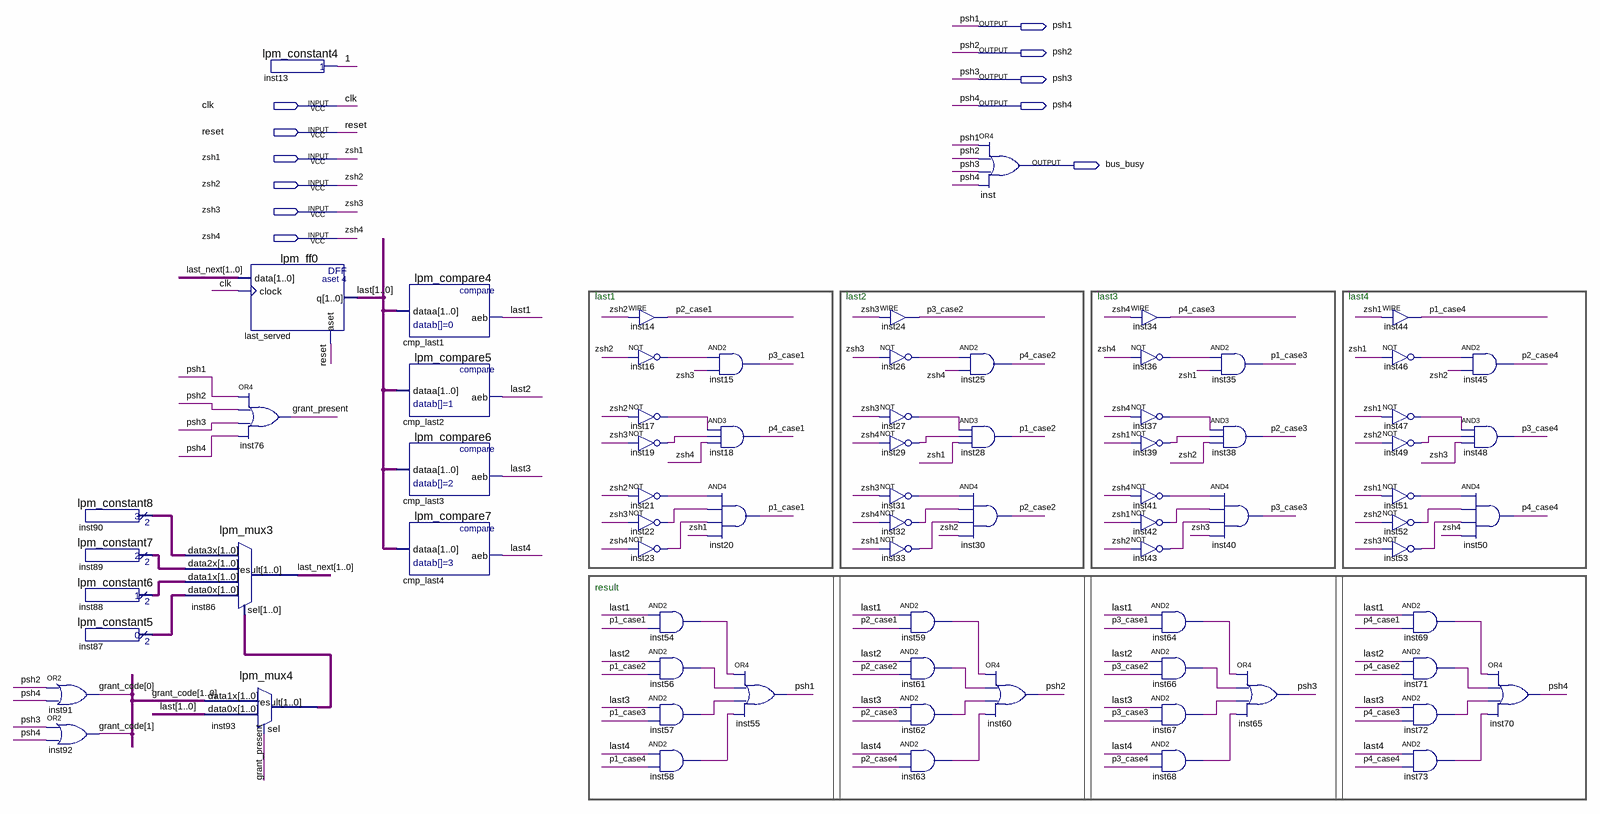
[diagram p0: schematic sheet]
// Quartus schematic arbiter.bdf as structural Verilog: 76 symbols, 11 pins
module arbiter (
  input  clk,
  input  reset,
  input  zsh1,
  input  zsh2,
  input  zsh3,
  input  zsh4,
  output psh1,
  output psh2,
  output psh3,
  output psh4,
  output bus_busy
);

  wire \1 , grant_present, inst16_out, inst17_out, inst19_out, inst21_out, inst22_out, inst23_out,
       inst26_out, inst27_out, inst29_out, inst31_out, inst32_out, inst33_out, inst36_out, inst37_out,
       inst39_out, inst41_out, inst42_out, inst43_out, inst46_out, inst47_out, inst49_out, inst51_out,
       inst52_out, inst53_out, inst54_out, inst56_out, inst57_out, inst58_out, inst59_out, inst61_out,
       inst62_out, inst63_out, inst64_out, inst66_out, inst67_out, inst68_out, inst69_out, inst71_out,
       inst72_out, inst73_out, last2, last3, last4, p1_case1, p1_case2, p1_case3, p1_case4, p2_case1,
       p2_case2, p2_case3, p2_case4, p3_case1, p3_case2, p3_case3, p3_case4, p4_case1, p4_case2, p4_case3,
       p4_case4;
  wire [1:0] grant_code, inst87_result, inst88_result, inst89_result, inst90_result, inst93_result, last,
       last_next;

  or inst91 (grant_code[0], psh2, psh4);
  or inst92 (grant_code[1], psh3, psh4);
  lpm_constant8 inst90 (.result(inst90_result));
  lpm_constant7 inst89 (.result(inst89_result));
  lpm_constant6 inst88 (.result(inst88_result));
  lpm_constant5 inst87 (.result(inst87_result));
  lpm_mux3 inst86 (
    .data3x(inst90_result), .data2x(inst89_result), .data1x(inst88_result), .data0x(inst87_result),
    .sel(inst93_result), .result(last_next));
  lpm_mux4 inst93 (.data1x(grant_code), .data0x(last), .sel(grant_present), .result(inst93_result));
  lpm_constant4 inst13 (.result(\1 ));
  lpm_ff0 last_served (.data(last_next), .clock(clk), .aset(reset), .q(last));
  or inst76 (grant_present, psh1, psh2, psh3, psh4);
  lpm_compare4 cmp_last1 (.dataa(last), .aeb(last[1]));
  lpm_compare5 cmp_last2 (.dataa(last), .aeb(last2));
  lpm_compare6 cmp_last3 (.dataa(last), .aeb(last3));
  lpm_compare7 cmp_last4 (.dataa(last), .aeb(last4));
  assign p2_case1 = zsh2;  // WIRE inst14
  not inst16 (inst16_out, zsh2);
  not inst17 (inst17_out, zsh2);
  not inst19 (inst19_out, zsh3);
  not inst21 (inst21_out, zsh2);
  not inst22 (inst22_out, zsh3);
  not inst23 (inst23_out, zsh4);
  and inst54 (inst54_out, last[1], p1_case1);
  and inst56 (inst56_out, last2, p1_case2);
  and inst57 (inst57_out, last3, p1_case3);
  and inst58 (inst58_out, last4, p1_case4);
  and inst15 (p3_case1, inst16_out, zsh3);
  and inst18 (p4_case1, inst17_out, inst19_out, zsh4);
  and inst20 (p1_case1, inst21_out, inst22_out, inst23_out, zsh1);
  or inst55 (psh1, inst54_out, inst56_out, inst57_out, inst58_out);
  assign p3_case2 = zsh3;  // WIRE inst24
  not inst26 (inst26_out, zsh3);
  not inst27 (inst27_out, zsh3);
  not inst29 (inst29_out, zsh4);
  not inst31 (inst31_out, zsh3);
  not inst32 (inst32_out, zsh4);
  not inst33 (inst33_out, zsh1);
  and inst59 (inst59_out, last[1], p2_case1);
  and inst61 (inst61_out, last2, p2_case2);
  and inst62 (inst62_out, last3, p2_case3);
  and inst63 (inst63_out, last4, p2_case4);
  and inst25 (p4_case2, inst26_out, zsh4);
  and inst28 (p1_case2, inst27_out, inst29_out, zsh1);
  and inst30 (p2_case2, inst31_out, inst32_out, inst33_out, zsh2);
  or inst (bus_busy, psh1, psh2, psh3, psh4);
  or inst60 (psh2, inst59_out, inst61_out, inst62_out, inst63_out);
  assign p4_case3 = zsh4;  // WIRE inst34
  not inst36 (inst36_out, zsh4);
  not inst37 (inst37_out, zsh4);
  not inst39 (inst39_out, zsh1);
  not inst41 (inst41_out, zsh4);
  not inst42 (inst42_out, zsh1);
  not inst43 (inst43_out, zsh2);
  and inst64 (inst64_out, last[1], p3_case1);
  and inst66 (inst66_out, last2, p3_case2);
  and inst67 (inst67_out, last3, p3_case3);
  and inst68 (inst68_out, last4, p3_case4);
  and inst35 (p1_case3, inst36_out, zsh1);
  and inst38 (p2_case3, inst37_out, inst39_out, zsh2);
  and inst40 (p3_case3, inst41_out, inst42_out, inst43_out, zsh3);
  or inst65 (psh3, inst64_out, inst66_out, inst67_out, inst68_out);
  assign p1_case4 = zsh1;  // WIRE inst44
  not inst46 (inst46_out, zsh1);
  not inst47 (inst47_out, zsh1);
  not inst49 (inst49_out, zsh2);
  not inst51 (inst51_out, zsh1);
  not inst52 (inst52_out, zsh2);
  not inst53 (inst53_out, zsh3);
  and inst69 (inst69_out, last[1], p4_case1);
  and inst71 (inst71_out, last2, p4_case2);
  and inst72 (inst72_out, last3, p4_case3);
  and inst73 (inst73_out, last4, p4_case4);
  and inst45 (p2_case4, inst46_out, zsh2);
  and inst48 (p3_case4, inst47_out, inst49_out, zsh3);
  and inst50 (p4_case4, inst51_out, inst52_out, inst53_out, zsh4);
  or inst70 (psh4, inst69_out, inst71_out, inst72_out, inst73_out);

  // Notes on the sheet:
  //   last1
  //   last2
  //   last3
  //   last4
  //   result
endmodule
